# EAGLE design AmpDiferencial (EAGLE 7.2.0)
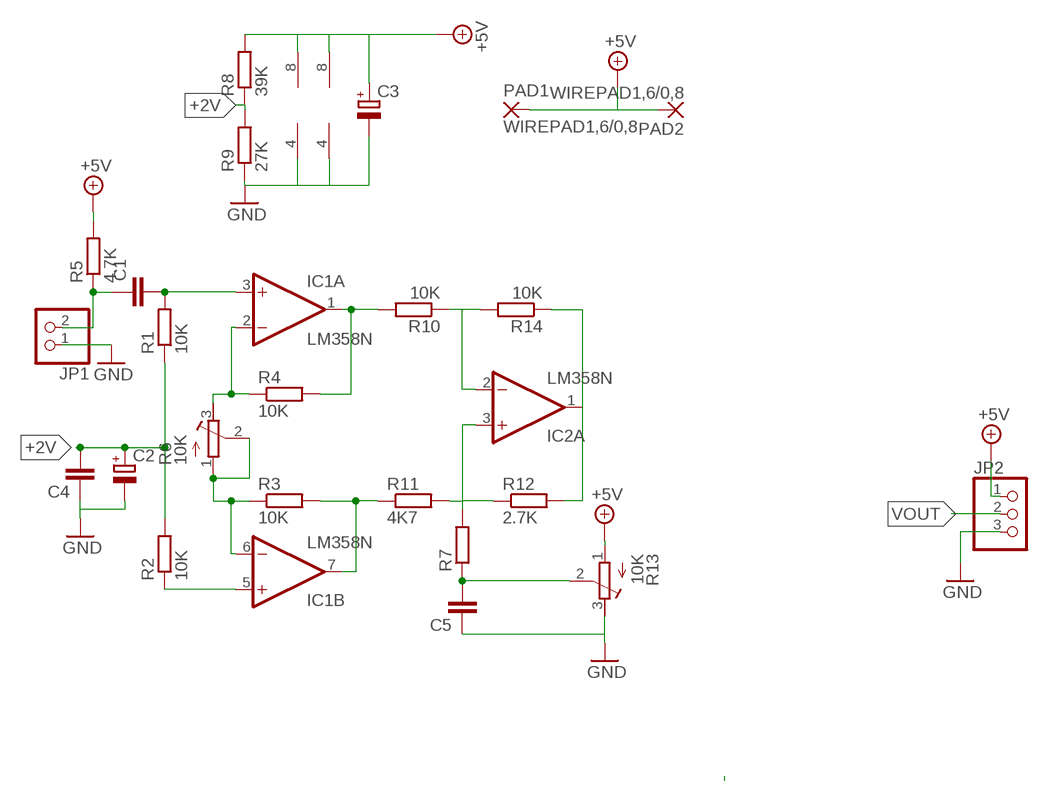
[diagram p0: schematic, sheet 1]

## Parts
C1  C-EU050-025X075  [C050-025X075]
C2  CPOL-EUE2.5-5  [E2,5-5]
C3  CPOL-EUE2.5-6  [E2,5-6]
C4  C-EU025-025X050  [C025-025X050]
C5  C-EU025-025X050  [C025-025X050]
IC1  LM358N  [DIL08]
IC2  LM358N  [DIL08]
JP1  PINHD-1X2  [1X02]
JP2  PINHD-1X3  [1X03]
PAD1  WIREPAD1,6/0,8  [1,6/0,8]
PAD2  WIREPAD1,6/0,8  [1,6/0,8]
R1  10K  R-EU_0207/7  [0207/7]
R2  10K  R-EU_0207/7  [0207/7]
R3  10K  R-EU_0207/7  [0207/7]
R4  10K  R-EU_0207/7  [0207/7]
R5  4.7K  R-EU_0207/7  [0207/7]
R6  10K  R-TRIMM64W  [RTRIM64W]
R7  R-EU_0207/7  [0207/7]
R8  39K  R-EU_0207/7  [0207/7]
R9  27K  R-EU_0207/7  [0207/7]
R10  10K  R-EU_0207/7  [0207/7]
R11  4K7  R-EU_0207/7  [0207/7]
R12  2.7K  R-EU_0207/7  [0207/7]
R13  10K  R-TRIMM64W  [RTRIM64W]
R14  10K  R-EU_0207/7  [0207/7]

## Nets
+2V: C2.+ C4.2 R1.1 R2.2 R8.1 R9.2
+5V: C3.+ IC1.8(P:V+) IC2.8(P:V+) JP2.1 PAD1.1(P) PAD2.1(P) R5.2 R8.2 R13.1(A)
GND: C2.- C3.- C4.1 C5.1 IC1.4(P:V-) IC2.4(P:V-) JP1.1 JP2.3 R9.1 R13.3(E)
N$1: IC1.2(A:-IN) R4.1 R6.3(E)
N$2: IC1.1(A:OUT) R4.2 R10.2
N$4: IC1.7(B:OUT) R3.2 R11.1
N$5: C1.1 JP1.2 R5.1
N$6: IC2.2(A:-IN) R10.1 R14.2
N$7: IC1.6(B:-IN) R3.1 R6.1(A) R6.2(S)
N$8: IC1.5(B:+IN) R2.1
N$9: C1.2 IC1.3(A:+IN) R1.2
N$10: IC2.3(A:+IN) R7.2 R11.2 R12.1
N$11: IC2.1(A:OUT) R12.2 R14.1
N$13: C5.2 R7.1 R13.2(S)
VOUT: JP2.2
Unconnected: IC2.5(B:+IN) IC2.6(B:-IN) IC2.7(B:OUT)

## Library data of the parts
C1 = resistor:C-EU: CAPACITOR, European symbol
C2 C3 = rcl:CPOL-EU: POLARIZED CAPACITOR, European symbol
C4 C5 = rcl:C-EU: CAPACITOR, European symbol
IC1 IC2 = linear:LM358: OP AMP also LM158; LM258; LM2904 Source: http://cache.national.com/ds/LM/LM158.pdf
JP1 = pinhead:PINHD-1X2: PIN HEADER
JP2 = pinhead:PINHD-1X3: PIN HEADER
PAD1 PAD2 = wirepad:WIREPAD: Wire PAD connect wire on PCB
R1-R5 R7-R12 R14 = resistor:R-EU_: RESISTOR, European symbol
R6 R13 = resistor:R-TRIMM: Trimm resistor

## Board
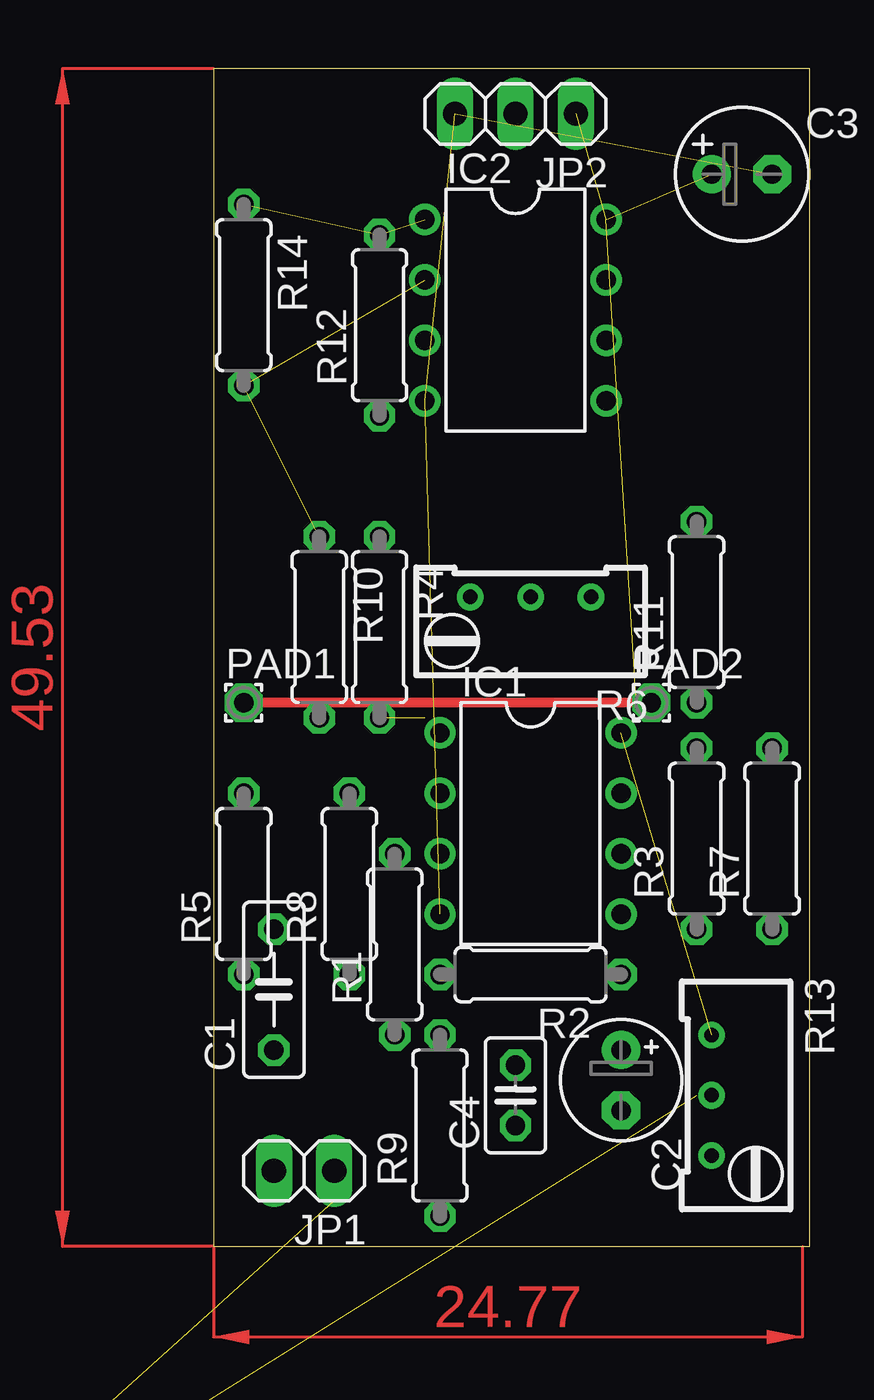
[diagram p1: board, top side]
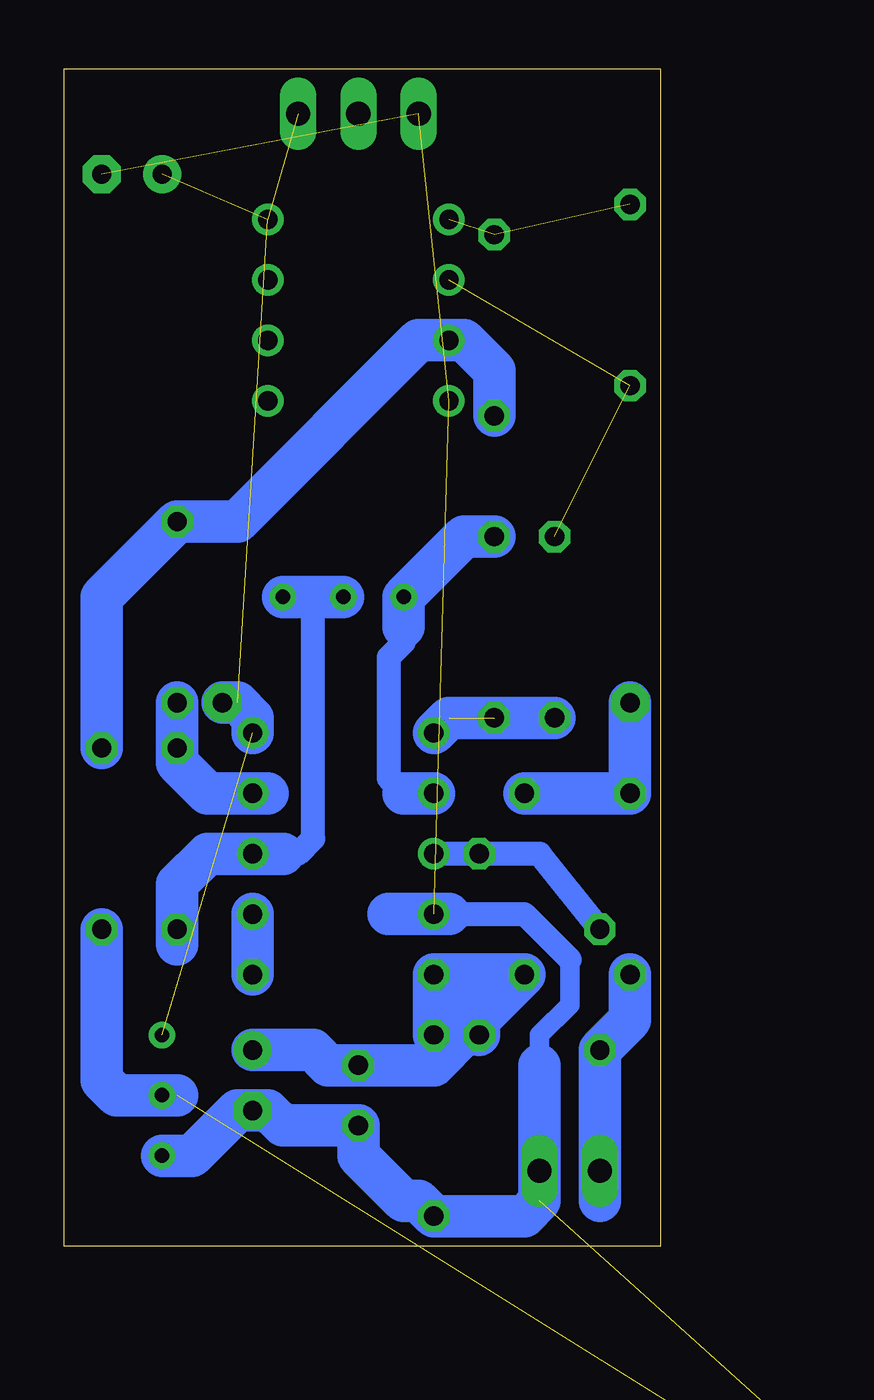
[diagram p2: board, bottom side, seen from below]

Size 25.07 x 49.52 mm. Coordinates in mm from the lower left corner, seen from the top.
Outline: 0,0 25.07,0 25.07,49.52 0,49.52 0,0
Copper layers (1*16): Top 0.035mm / dielectric 1.5mm / Bottom 0.035mm
Design rules "default": minimum track width 10mil, minimum drill 24mil, track to track 8mil, track to pad 8mil, pad to pad 8mil, via to via 8mil, smd to smd 8mil, copper to edge 40mil, drill to drill 8mil, minimum pad ring 10mil, minimum via ring 8mil, stop-mask expansion 4mil, vias tented up to drill 0mil, thermal gap 10mil

### Footprints (pad centres in the part's own frame; a part is rotated, then mirrored left to right if it is on the bottom)
C050-025X075 = drill 0.813 octagon: 1 -2.54,0; 2 2.54,0
E2,5-5 = drill 0.813 pad 1.6: + -1.27,0 | drill 0.813 pad 1.6 octagon: - 1.27,0
E2,5-6 = drill 0.813 pad 1.6: + -1.27,0 | drill 0.813 pad 1.6 octagon: - 1.27,0
C025-025X050 = drill 0.813 octagon: 1 -1.27,0; 2 1.27,0
DIL08 = drill 0.813 pad 1.27: 1 -3.81,-3.81; 2 -1.27,-3.81; 3 1.27,-3.81; 4 3.81,-3.81; 5 3.81,3.81; 6 1.27,3.81; 7 -1.27,3.81; 8 -3.81,3.81
1X02 = drill 1.016 long: 1 -1.27,0; 2 1.27,0
1X03 = drill 1.016 long: 1 -2.54,0; 2 0,0; 3 2.54,0
1,6/0,8 = drill 0.813 pad 1.6 octagon: 1 0,0
0207/7 = drill 0.813 octagon: 1 -3.81,0; 2 3.81,0
RTRIM64W = drill 0.61: 1 1.27,-2.54; 2 1.27,0; 3 1.27,2.54

### Placement (x,y rotation side)
C1  2.54,10.79 90 top
C2  17.14,6.98 270 top
C3  22.23,45.09 0 top
C4  12.7,6.35 90 top
C5  -6.35,-9.53 0 top  (outside the outline)
IC1  13.34,17.78 270 top
IC2  12.7,39.37 270 top
JP1  3.81,3.18 180 top
JP2  12.7,47.62 180 top
PAD1  1.27,22.86 0 top
PAD2  18.41,22.86 0 top
R1  7.62,12.7 90 top
R2  13.34,11.43 180 top
R3  20.32,17.15 90 top
R4  6.99,26.03 270 top
R5  1.27,15.24 90 top
R6  13.34,26.03 90 top
R7  23.5,17.15 90 top
R8  5.72,15.24 90 top
R9  9.52,5.08 90 top
R10  4.45,26.03 270 top
R11  20.32,26.67 90 top
R12  6.99,38.73 90 top
R13  22.23,6.35 180 top
R14  1.27,40.01 270 top

### Tracks (layer width: path | path; a pad name or v marks a point on that pad's centre or on a via)
+2V
  Bottom 1.778: R1.1 7.62,9.53 R8.1 R2.2 R9.2 8.89,9.53 8.89,10.79 8.25,10.16 8.25,8.89 9.52,7.62 C4.2 13.97,7.62 14.61,8.26 C2.+
+5V  (4 unrouted)
  Top 0.406: PAD1.1 PAD2.1
  Bottom 1.778: IC1.8 17.14,22.23 17.78,22.86 PAD2.1 | R8.2 R5.2 PAD1.1
GND  (4 unrouted)
  Bottom 0.813: 3.81,12.06 3.81,10.16 5.08,8.89 5.08,7.62
  Bottom 1.016: 8.89,13.97 5.72,13.97 3.81,12.06
  Bottom 1.778: 5.08,7.62 JP1.1 5.08,1.91 5.72,1.27 R9.1 10.16,1.91 10.8,1.91 12.7,3.81 C4.1 15.88,5.08 16.51,5.71 C2.- 17.78,5.71 19.69,3.81 R13.3 | 8.89,13.97 IC1.4 11.43,13.97
N$1
  Bottom 1.016: 10.8,26.03 10.8,25.4 11.43,24.77 11.43,19.69 10.8,19.05
  Bottom 1.778: 10.8,26.03 R6.3 8.25,29.84 R4.1 | 10.8,19.05 IC1.2
N$2  (1 unrouted)
  Bottom 1.778: R10.2 8.89,22.23 IC1.1
N$4
  Bottom 1.778: 16.51,19.05 IC1.7 19.05,19.05 20.32,20.32 R3.2 R11.1
N$5
  Bottom 1.778: 2.54,1.91 JP1.2 C1.1 1.27,9.53 R5.1
N$6  (2 unrouted)
N$7
  Bottom 1.016: 15.88,16.51 15.24,16.51 14.61,17.15 14.61,27.3
  Bottom 1.778: R6.1 14.61,27.3 R6.2 | 15.88,16.51 IC1.6 19.05,16.51 20.32,15.24 R3.1 20.32,12.7
N$8
  Bottom 1.778: R2.1 IC1.5
N$9
  Bottom 1.016: C1.2 5.08,16.51 R1.2 IC1.3
N$10
  Bottom 1.778: R7.2 23.5,27.3 R11.2 17.78,30.48 10.16,38.1 IC2.3 8.25,38.1 6.99,36.83 R12.1
N$11  (2 unrouted)
N$13  (1 unrouted)
  Bottom 1.778: 20.32,6.35 R13.2 22.86,6.35 23.5,6.98 R7.1
(copper drawn outside any net)
  shapes: Top area x2